# Altium schematic sheet Sheet2.SchDoc
size A; SheetNumber: 1; SheetTotal: 1
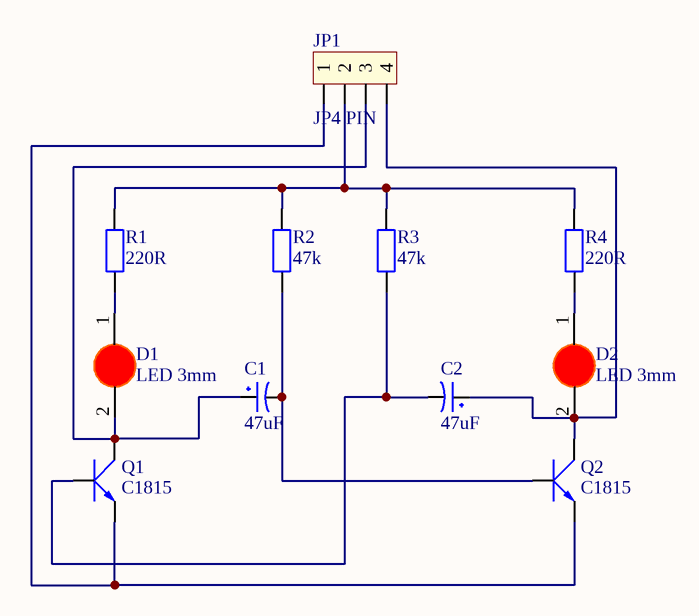
[diagram p0: Sheet2.SchDoc]

## Parts
C1  47uF  [tu hoa 5mm]
C2  47uF  [tu hoa 5mm]
D1  LED 3mm  [LED-3MM-RED]
D2  LED 3mm  [LED-3MM-RED]
JP1  JP4 PIN  [JP4]
Q1  C1815  [TO92]
Q2  C1815  [TO92]
R1  220R  [tro vach 1/4w]
R2  47k  [tro vach 1/4w]
R3  47k  [tro vach 1/4w]
R4  220R  [tro vach 1/4w]

## Nets
NetC1_1: C1.1 D1.2(K) JP1.3 Q1.2(C)
NetC1_2: C1.2 Q2.3(B) R2.1
NetC2_1: C2.1 D2.2(K) JP1.4 Q2.2(C)
NetC2_2: C2.2 Q1.3(B) R3.1
NetD1_1: D1.1(A) R1.1
NetD2_1: D2.1(A) R4.1
NetJP1_1: JP1.1 Q1.1(E) Q2.1(E)
NetJP1_2: JP1.2 R1.2 R2.2 R3.2 R4.2

## Library data of the parts
C1 C2 = Tu Hoa 47uF 16V 5x10: Cắm; Don_Vi: Con; So_Chan: 2; Ten_Linh_Kien: Tụ Hóa 47uF 16V; Ma_Hang: MH006859; Chung_Loai: Cắm; Kieu_Chan: *
D1 D2 = LED 3mm Do: Cắm; Don_Vi: Con; Ma_Hang: MH003892; Ten_Linh_Kien: Led 3MM Phủ Đỏ (10c); Ghi_Chu: *; Kieu_Chan: *; Chung_Loai: Cắm
JP1 = JP4: Value: JP4
Q1 Q2 = Trans C1815 DIP: NPN transistor; Value: C9014
R1 R4 = Tro Vach 1/4W 5% 220R: Cắm; Don_Vi: Con; So_Chan: 2; Ten_Linh_Kien: Trở Vạch 1/4w 5% 220R; Ma_Hang: MH007300; Chung_Loai: Cắm; Kieu_Chan: *
R2 R3 = Tro Vach 1/4W 5% 47k: Cắm; Don_Vi: Con; So_Chan: 2; Ten_Linh_Kien: Trở Vạch 1/4w 5% 47k; Ma_Hang: MH004982; Chung_Loai: Cắm; Kieu_Chan: *